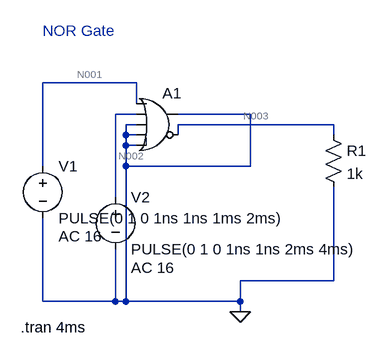
[diagram p0: schematic EEE_LG_5.asc]
EEE_LG_5.asc, the LTspice schematic file:
Version 4
SHEET 1 880 680
WIRE 80 48 -64 48
WIRE 80 80 80 48
WIRE 80 96 48 96
WIRE 256 96 144 96
WIRE 80 112 64 112
WIRE 384 112 144 112
WIRE 64 128 64 112
WIRE 80 128 64 128
WIRE 144 128 144 112
WIRE 384 128 384 112
WIRE 64 144 64 128
WIRE 80 144 64 144
WIRE -64 176 -64 48
WIRE 64 176 64 144
WIRE 256 176 256 96
WIRE 256 176 64 176
WIRE 48 224 48 96
WIRE 384 352 384 208
WIRE 384 352 240 352
WIRE -64 384 -64 256
WIRE 48 384 48 304
WIRE 48 384 -64 384
WIRE 64 384 64 176
WIRE 64 384 48 384
WIRE 240 384 240 352
WIRE 240 384 64 384
WIRE 240 400 240 384
FLAG 240 400 0
SYMBOL voltage -64 160 R0
WINDOW 123 24 124 Left 2
WINDOW 39 0 0 Left 0
SYMATTR InstName V1
SYMATTR Value PULSE(0 1 0 1ns 1ns 1ms 2ms)
SYMATTR Value2 AC 16
SYMBOL voltage 48 208 R0
WINDOW 123 24 124 Left 2
WINDOW 39 0 0 Left 0
SYMATTR InstName V2
SYMATTR Value PULSE(0 1 0 1ns 1ns 2ms 4ms)
SYMATTR Value2 AC 16
SYMBOL res 368 112 R0
SYMATTR InstName R1
SYMATTR Value 1k
SYMBOL Digital\\or 112 48 R0
SYMATTR InstName A1
TEXT -64 -32 Left 2 ;NOR Gate
TEXT -98 424 Left 2 !.tran 4ms

The netlist it stands for:
* EEE_LG_5.asc
V1 N001 0 PULSE(0 1 0 1ns 1ns 1ms 2ms) AC 16
V2 N002 0 PULSE(0 1 0 1ns 1ns 2ms 4ms) AC 16
R1 N003 0 1k
A1 N001 N002 0 0 0 N003 0 0 OR
* NOR Gate
.tran 4ms
.backanno
.end

* Results of the author's LTspice run, read from the files saved beside the schematic
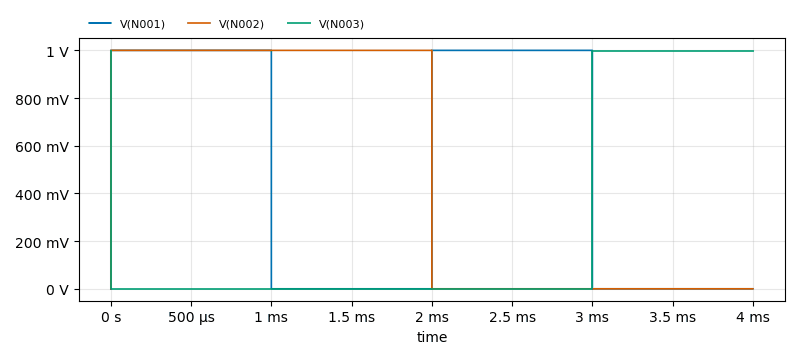
[diagram p1: Transient Analysis of EEE_LG_5.asc, plotted from the saved traces]
* Transient Analysis, 1 run:
*   V(N001): min 0 V, max 1 V, average 500 mV, rms 707.1 mV, last 0 V
*   V(N002): min 0 V, max 1 V, average 500 mV, rms 707.1 mV, last 0 V
*   V(N003): min 0 V, max 999 mV, average 249.8 mV, rms 499.5 mV, last 999 mV